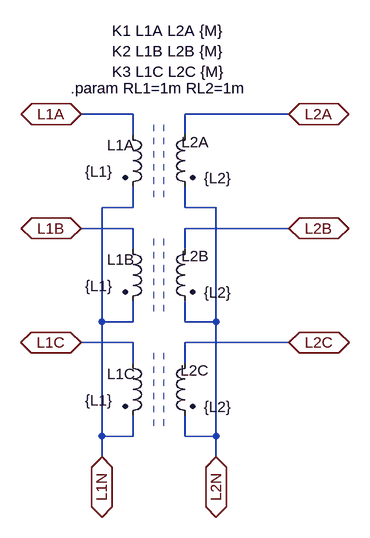
[diagram p0: schematic trafo3yy.asc]
trafo3yy.asc, the LTspice schematic file:
Version 4
SHEET 1 880 744
WIRE 272 112 192 112
WIRE 512 112 352 112
WIRE 272 144 272 112
WIRE 352 144 352 112
WIRE 272 256 272 224
WIRE 272 256 224 256
WIRE 352 256 352 224
WIRE 400 256 352 256
WIRE 272 288 192 288
WIRE 512 288 352 288
WIRE 272 320 272 288
WIRE 352 320 352 288
WIRE 224 432 224 256
WIRE 272 432 272 400
WIRE 272 432 224 432
WIRE 352 432 352 400
WIRE 400 432 400 256
WIRE 400 432 352 432
WIRE 272 464 192 464
WIRE 512 464 352 464
WIRE 272 496 272 464
WIRE 352 496 352 464
WIRE 224 608 224 432
WIRE 272 608 272 576
WIRE 272 608 224 608
WIRE 352 608 352 576
WIRE 400 608 400 432
WIRE 400 608 352 608
WIRE 224 640 224 608
WIRE 400 640 400 608
FLAG 192 112 L1A
IOPIN 192 112 BiDir
FLAG 192 288 L1B
IOPIN 192 288 BiDir
FLAG 512 112 L2A
IOPIN 512 112 BiDir
FLAG 512 288 L2B
IOPIN 512 288 BiDir
FLAG 192 464 L1C
IOPIN 192 464 BiDir
FLAG 512 464 L2C
IOPIN 512 464 BiDir
FLAG 400 640 L2N
IOPIN 400 640 BiDir
FLAG 224 640 L1N
IOPIN 224 640 BiDir
SYMBOL ind2 256 128 R0
WINDOW 0 -24 32 Left 2
WINDOW 3 -58 73 Left 2
SYMATTR InstName L1A
SYMATTR Value {L1}
SYMATTR Type ind
SYMATTR SpiceLine Rser={RL1}
SYMBOL ind2 368 128 M0
WINDOW 0 -21 27 Left 2
WINDOW 3 -57 83 Left 2
SYMATTR InstName L2A
SYMATTR Value {L2}
SYMATTR Type ind
SYMATTR SpiceLine Rser={RL2}
SYMBOL ind2 256 304 R0
WINDOW 0 -24 32 Left 2
WINDOW 3 -58 73 Left 2
SYMATTR InstName L1B
SYMATTR Value {L1}
SYMATTR Type ind
SYMATTR SpiceLine Rser={RL1}
SYMBOL ind2 368 304 M0
WINDOW 0 -21 27 Left 2
WINDOW 3 -57 83 Left 2
SYMATTR InstName L2B
SYMATTR Value {L2}
SYMATTR Type ind
SYMATTR SpiceLine Rser={RL2}
SYMBOL ind2 256 480 R0
WINDOW 0 -24 32 Left 2
WINDOW 3 -58 73 Left 2
SYMATTR InstName L1C
SYMATTR Value {L1}
SYMATTR Type ind
SYMATTR SpiceLine Rser={RL1}
SYMBOL ind2 368 480 M0
WINDOW 0 -21 27 Left 2
WINDOW 3 -57 83 Left 2
SYMATTR InstName L2C
SYMATTR Value {L2}
SYMATTR Type ind
SYMATTR SpiceLine Rser={RL2}
TEXT 240 -16 Left 2 !K1 L1A L2A {M}\nK2 L1B L2B {M}\nK3 L1C L2C {M}
TEXT 176 72 Left 2 !.param RL1=1m RL2=1m
LINE Normal 304 240 304 128 2
LINE Normal 320 240 320 128 2
LINE Normal 304 416 304 304 2
LINE Normal 320 416 320 304 2
LINE Normal 304 592 304 480 2
LINE Normal 320 592 320 480 2

The netlist it stands for:
* trafo3yy.asc
L1A L1A L1N {L1} Rser={RL1}
L2A L2A L2N {L2} Rser={RL2}
L1B L1B L1N {L1} Rser={RL1}
L2B L2B L2N {L2} Rser={RL2}
L1C L1C L1N {L1} Rser={RL1}
L2C L2C L2N {L2} Rser={RL2}
K1 L1A L2A {M}
K2 L1B L2B {M}
K3 L1C L2C {M}
.param RL1=1m RL2=1m
.backanno
.end